# Altium schematic sheet 03_INDEX.SchDoc
size 420 x 297 mm; SheetNumber: 3; SheetTotal: 28
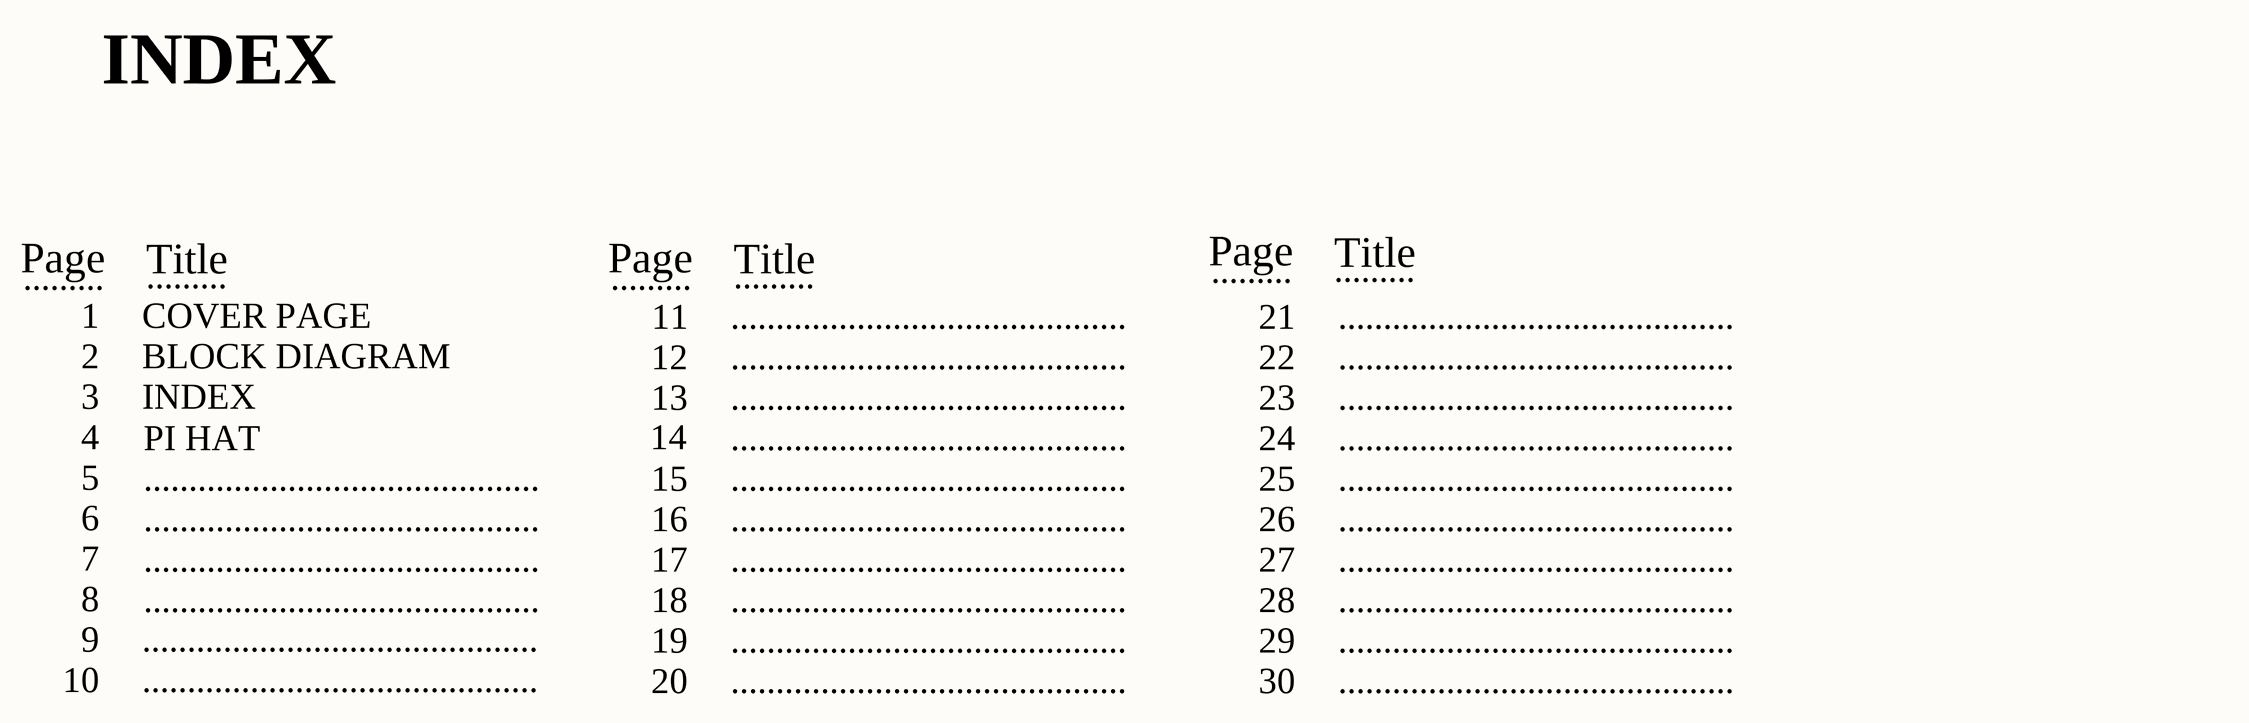
[diagram p0: 03_INDEX.SchDoc]

## Notes on the sheet
- INDEX
- Page
- .........
- Title
- 1
- 2
- COVER PAGE
- BLOCK DIAGRAM
- 11
- 12
- ............................................
- 21
- 22
- 3
- 4
- 14
- 13
- 23
- 5
- PI HAT
- 15
- 24
- 25
- 6
- 7
- 16
- 17
- 26
- 27
- 8
- 18
- 28
- 9
- 10
- 19
- 20
- 29
- 30
- Project:
- Sub-system:
- Design by:
- Sheet title:
- Sheet
- of
- Checked by:
- Approved by:
- Revision:
- Document No:
- Size:
- Date:
- A3